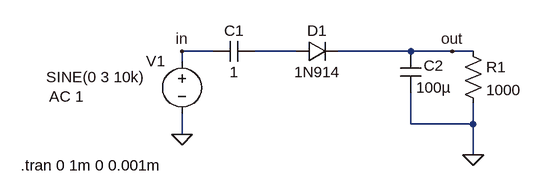
[diagram p0: schematic rectifier_with_silicon.asc]
rectifier_with_silicon.asc, the LTspice schematic file:
Version 4
SHEET 1 1460 784
WIRE 32 96 -16 96
WIRE 160 96 96 96
WIRE 336 96 224 96
WIRE 400 96 336 96
WIRE 432 96 400 96
WIRE -16 112 -16 96
WIRE 336 208 336 160
WIRE 432 208 432 176
WIRE 432 208 336 208
WIRE -16 224 -16 192
WIRE 432 256 432 208
FLAG 432 256 0
FLAG -16 224 0
FLAG 400 96 out
FLAG -16 96 in
SYMBOL diode 160 112 R270
WINDOW 0 32 32 VTop 2
WINDOW 3 0 32 VBottom 2
SYMATTR InstName D1
SYMATTR Value 1N914
SYMBOL res 416 80 R0
SYMATTR InstName R1
SYMATTR Value 1000
SYMBOL cap 96 80 R90
WINDOW 0 0 32 VBottom 2
WINDOW 3 32 32 VTop 2
SYMATTR InstName C1
SYMATTR Value 1
SYMBOL voltage -16 96 R0
WINDOW 123 -204 70 Left 2
WINDOW 39 0 0 Left 0
WINDOW 3 -209 40 Left 2
WINDOW 0 -55 15 Left 2
SYMATTR Value2 AC 1
SYMATTR Value SINE(0 3 10k)
SYMATTR InstName V1
SYMBOL cap 320 96 R0
WINDOW 0 36 22 Left 2
SYMATTR InstName C2
SYMATTR Value 100µ
TEXT -264 272 Left 2 !.tran 0 1m 0 0.001m

The netlist it stands for:
* rectifier_with_silicon.asc
D1 N001 out 1N914
R1 out 0 1000
C1 N001 in 1
V1 in 0 SINE(0 3 10k) AC 1
C2 out 0 100µ
.model D D
.lib standard.dio
.tran 0 1m 0 0.001m
.backanno
.end